# EAGLE design 328_smt_testing (EAGLE 7.2.0)
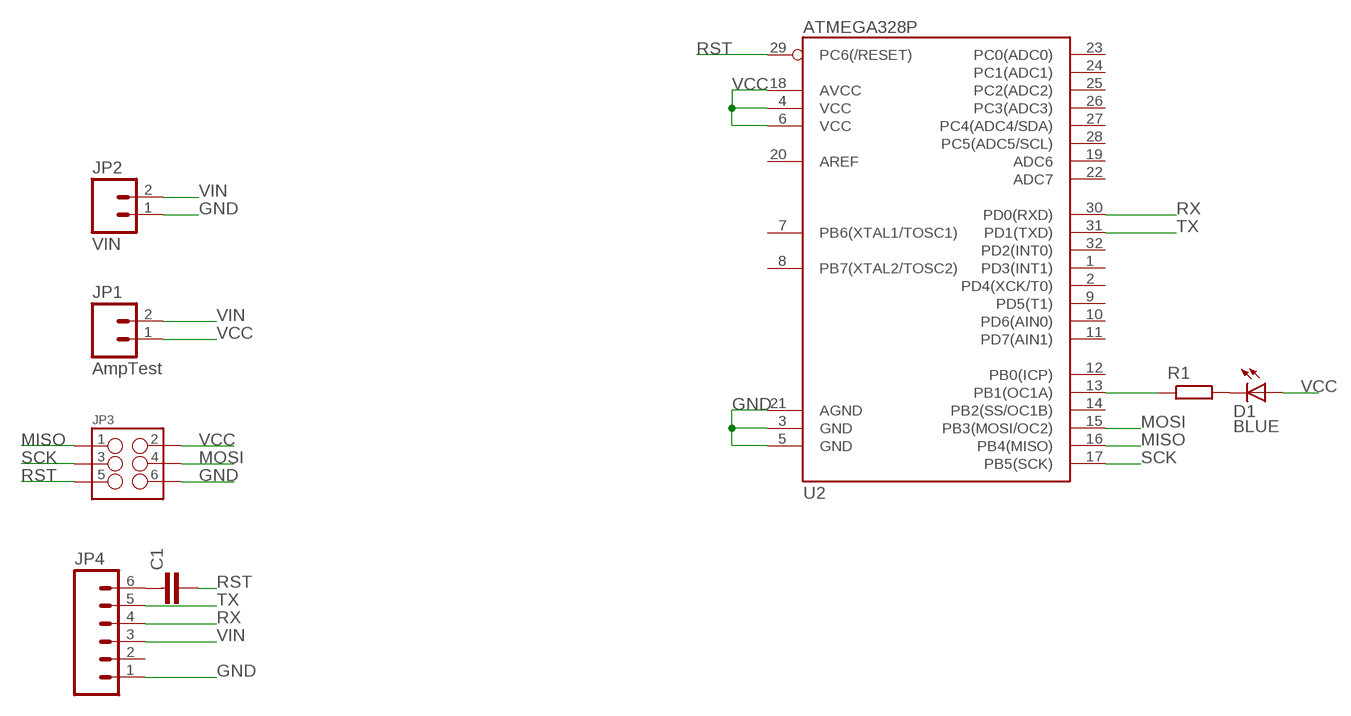
[diagram p0: schematic, sheet 1]

## Parts
C1  CAPACITOR0603-N  [C0603-N]
D1  BLUE  LED-BLUE0603  [LED-0603]
JP1  AmpTest  M02LOCK_LONGPADS  [1X02_LOCK_LONGPADS]
JP2  VIN  M02LOCK_LONGPADS  [1X02_LOCK_LONGPADS]
JP3  M03X2FEMALE_SMD  [2X3_SMD]
JP4  M06LOCK_LONGPADS  [1X06_LOCK_LONGPADS]
R1  RESISTOR0603-L  [R0603-L]
U2  ATMEGA328P  ATMEGA328_SMT  [TQFP32-08]

## Nets
GND: JP2.1 JP3.6 JP4.1 U2.3(GND) U2.5(GND) U2.21(AGND)
MISO: JP3.1 U2.16(PB4(MISO))
MOSI: JP3.4 U2.15(PB3(MOSI/OC2))
N$2: D1.C R1.2
N$6: C1.1 JP4.6
N$8: R1.1 U2.13(PB1(OC1A))
RST: C1.2 JP3.5 U2.29(PC6(/RESET))
RX: JP4.4 U2.30(PD0(RXD))
SCK: JP3.3 U2.17(PB5(SCK))
TX: JP4.5 U2.31(PD1(TXD))
VCC: D1.A JP1.1 JP3.2 U2.4(VCC) U2.6(VCC) U2.18(AVCC)
VIN: JP1.2 JP2.2 JP4.3
Unconnected: JP4.2 U2.1(PD3(INT1)) U2.2(PD4(XCK/T0)) U2.7(PB6(XTAL1/TOSC1)) U2.8(PB7(XTAL2/TOSC2)) U2.9(PD5(T1)) U2.10(PD6(AIN0)) U2.11(PD7(AIN1)) U2.12(PB0(ICP)) U2.14(PB2(SS/OC1B)) U2.19(ADC6) U2.20(AREF) U2.22(ADC7) U2.23(PC0(ADC0)) U2.24(PC1(ADC1)) U2.25(PC2(ADC2)) U2.26(PC3(ADC3)) U2.27(PC4(ADC4/SDA)) U2.28(PC5(ADC5/SCL)) U2.32(PD2(INT0))

## Library data of the parts
C1 = passives-7351:CAPACITOR
D1 = SparkFun-LED:LED-BLUE: Blue LEDs for production use Various blue LEDs stocked by SparkFun production 0603 - DIO-08575 Rebel - DIO-09553 1206 - DIO-09911; PROD_ID: DIO-08575
JP1 JP2 = SparkFun-Connectors:M02: Standard 2-pin 0.1" header. Use with - straight break away headers ( PRT-00116) - right angle break away headers (PRT-00553) - swiss pins (PRT-00743) - machine pins (PRT-00117) - female headers (PRT-00115) Molex polarized connector foot print use with: PRT-08233 with associated crimp pins and housings. 2.54_SCREWTERM for use with PRT-10571. 3.5mm Screw Terminal footprints for PRT-08084 5mm Screw Terminal footprints for use with PRT-08433
JP3 = SparkFun-Connectors:M03X2: 2x3 .1" header. Shrouded, with keying- CONN-10681 SMT- CONN-11415 Pogo pins- HW-11044; PROD_ID: CONN-11290
JP4 = SparkFun-Connectors:M06: Header 6 Standard 6-pin 0.1" header. Use with straight break away headers (SKU : PRT-00116), right angle break away headers (PRT-00553), swiss pins (PRT-00743), machine pins (PRT-00117), and female headers (PRT-00115). Molex polarized connector foot print use with SKU : PRT-08094 with associated crimp pins and housings. NOTES ON THE VARIANTS LOCK and LOCK_LONGPADS... This footprint was designed to help hold the alignment of a through-hole component (i.e. 6-pin header) while soldering it into place. You may notice that each hole has been shifted either up or down by 0.005 of an inch from it's more standard position (which is a perfectly straight line). This slight alteration caused the pins (the squares in the middle) to touch the edges of the holes. Because they are alternating, it causes a "brace" to hold the component in place. 0.005 has proven to be the perfect amount of "off-center" position when using our standard breakaway headers. Although looks a little odd when you look at the bare footprint, once you have a header in there, the alteration is very hard to notice. Also,if you push a header all the way into place, it is covered up entirely on the bottom side. This idea of altering the position of holes to aid alignment will be further integrated into the Sparkfun Library for other footprints. It can help hold any component with 3 or more connection pins.
R1 = passives-7351:RESISTOR
U2 = SparkFun-DigitalIC:ATMEGA328_SMT: 32-Pin Atmega328 part Commonly used on Arduino compatible boards Available in QFP and QFN packages TQFP is IC-09069 QFN is non-stock; PROD_ID: IC-09069

## Board
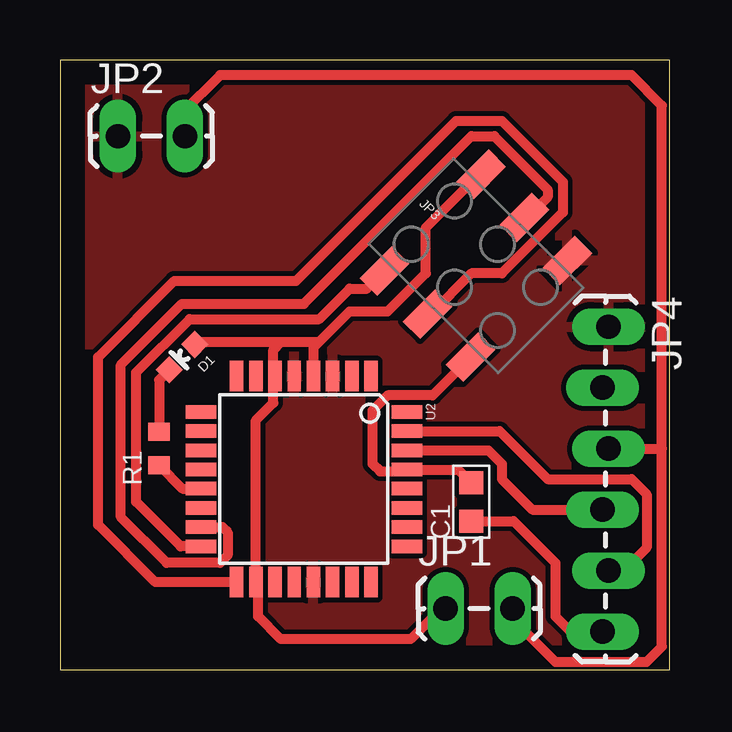
[diagram p1: board, top side]

Size 25.4 x 25.4 mm. Coordinates in mm from the lower left corner, seen from the top.
Outline: 0,0 25.4,0 25.4,25.4 0,25.4 0,0
Copper layers (1*16): Top 0.035mm / dielectric 1.5mm / Bottom 0.035mm
Design rules "default": minimum track width 10mil, minimum drill 24mil, track to track 8mil, track to pad 8mil, pad to pad 8mil, via to via 8mil, smd to smd 8mil, copper to edge 40mil, drill to drill 8mil, minimum pad ring 10mil, minimum via ring 8mil, stop-mask expansion 4mil, vias tented up to drill 0mil, thermal gap 10mil

### Footprints (pad centres in the part's own frame; a part is rotated, then mirrored left to right if it is on the bottom)
C0603-N = smd 0.95 x 1: 1 -0.8,0; 2 0.8,0
LED-0603 = smd 0.8 x 0.8: A 0,-0.75; C 0,0.75
1X02_LOCK_LONGPADS = drill 1.016 long: 1 -0.127,0; 2 2.667,0
2X3_SMD = smd 1.02 x 1.9: 1 -2.54,-2.85; 2 -2.54,2.85; 3 0,-2.85; 4 0,2.85; 5 2.54,-2.85; 6 2.54,2.85
1X06_LOCK_LONGPADS = drill 1.016 long: 1 0,0; 2 2.54,-0.254; 3 5.08,0; 4 7.62,-0.254; 5 10.16,0; 6 12.7,-0.254
R0603-L = smd 0.75 x 0.9: 1 -0.7,0; 2 0.7,0
TQFP32-08 = smd 1.27 x 0.559: 1 -4.293,2.8; 2 -4.293,2; 3 -4.293,1.2; 4 -4.293,0.4; 5 -4.293,-0.4; 6 -4.293,-1.2; 7 -4.293,-2; 8 -4.293,-2.8; 17 4.293,-2.8; 18 4.293,-2; 19 4.293,-1.2; 20 4.293,-0.4; 21 4.293,0.4; 22 4.293,1.2; 23 4.293,2; 24 4.293,2.8 | smd 0.559 x 1.27: 9 -2.8,-4.293; 10 -2,-4.293; 11 -1.2,-4.293; 12 -0.4,-4.293; 13 0.4,-4.293; 14 1.2,-4.293; 15 2,-4.293; 16 2.8,-4.293; 25 2.8,4.293; 26 2,4.293; 27 1.2,4.293; 28 0.4,4.293; 29 -0.4,4.293; 30 -1.2,4.293; 31 -2,4.293; 32 -2.8,4.293

### Placement (x,y rotation side)
C1  17.14,6.99 90 top
D1  5.08,13.02 135 top
JP1  16.19,2.54 0 top
JP2  2.54,22.23 0 top
JP3  17.33,16.83 315 top
JP4  22.86,14.29 270 top
R1  4.13,9.21 90 top
U2  10.16,7.94 270 top

### Tracks (layer width: path | path; a pad name or v marks a point on that pad's centre or on a via)
GND
  pour Top: 0,0 25.4,0 25.4,25.4 0,25.4
MISO
  Top 0.406: 13.3,16.83 arc-90 JP3.1 12.79,15.88 12.06,15.88 10.79,14.61 5.4,14.61 3.17,12.38 3.17,6.99 5.02,5.14 U2.16
MOSI
  Top 0.406: U2.15 6.76,5.94 6.99,5.71 6.99,4.76 6.67,4.45 4.45,4.45 2.54,6.35 2.54,12.7 5.08,15.24 10.16,15.24 17.14,22.23 18.1,22.23 20.32,20 20.32,19.68 19.48,18.84 JP3.4
N$2
  Top 0.406: D1.C 4.13,12.06 R1.2
N$6
  Top 0.406: C1.1 18.9,6.18 20.64,4.45 20.64,2.22 21.27,1.59 JP4.6
N$8
  Top 0.406: R1.1 5.1,7.54 U2.13
RST
  Top 0.406: JP3.5 15.53,11.43 13.65,11.43 13.02,10.79 13.02,8.57 13.34,8.26 14.37,8.26 U2.29 16.59,8.34 C1.2
RX
  Top 0.406: U2.30 17.85,9.14 18.41,8.57 18.41,7.94 19.68,6.67 JP4.4
SCK
  Top 0.406: U2.17 3.98,3.65 1.59,6.03 1.59,13.02 4.76,16.19 9.84,16.19 16.51,22.86 18.41,22.86 20.95,20.32 20.95,19.05 18.41,16.51 17.14,16.51 15.45,14.81 JP3.3
TX
  Top 0.406: U2.31 18.32,9.94 20.32,7.94 23.81,7.94 24.45,7.3 24.45,5.08 23.5,4.13 JP4.5
VCC
  Top 0.406: 8.89,12.16 8.89,11.11 8.16,10.38 U2.18 8.26,3.55 8.26,2.22 9.21,1.27 14.61,1.27 15.88,2.54 JP1.1 | 8.89,12.16 U2.6 | 8.89,12.16 8.89,13.34 9.21,13.65 | 9.21,13.65 10.79,13.65 | 10.79,13.65 10.56,13.42 U2.4 | D1.A 5.71,13.65 9.21,13.65 | 10.79,13.65 12.06,14.92 13.65,14.92 15.24,16.51 15.24,18.41 17.46,20.64 JP3.2
VIN
  Top 0.406: JP4.3 25.08,9.21 | JP1.2 18.86,2.1 20.64,0.32 24.45,0.32 25.08,0.95 25.08,9.21 | 25.08,9.21 25.08,23.5 23.81,24.77 6.67,24.77 5.08,23.18 5.08,22.35 JP2.2